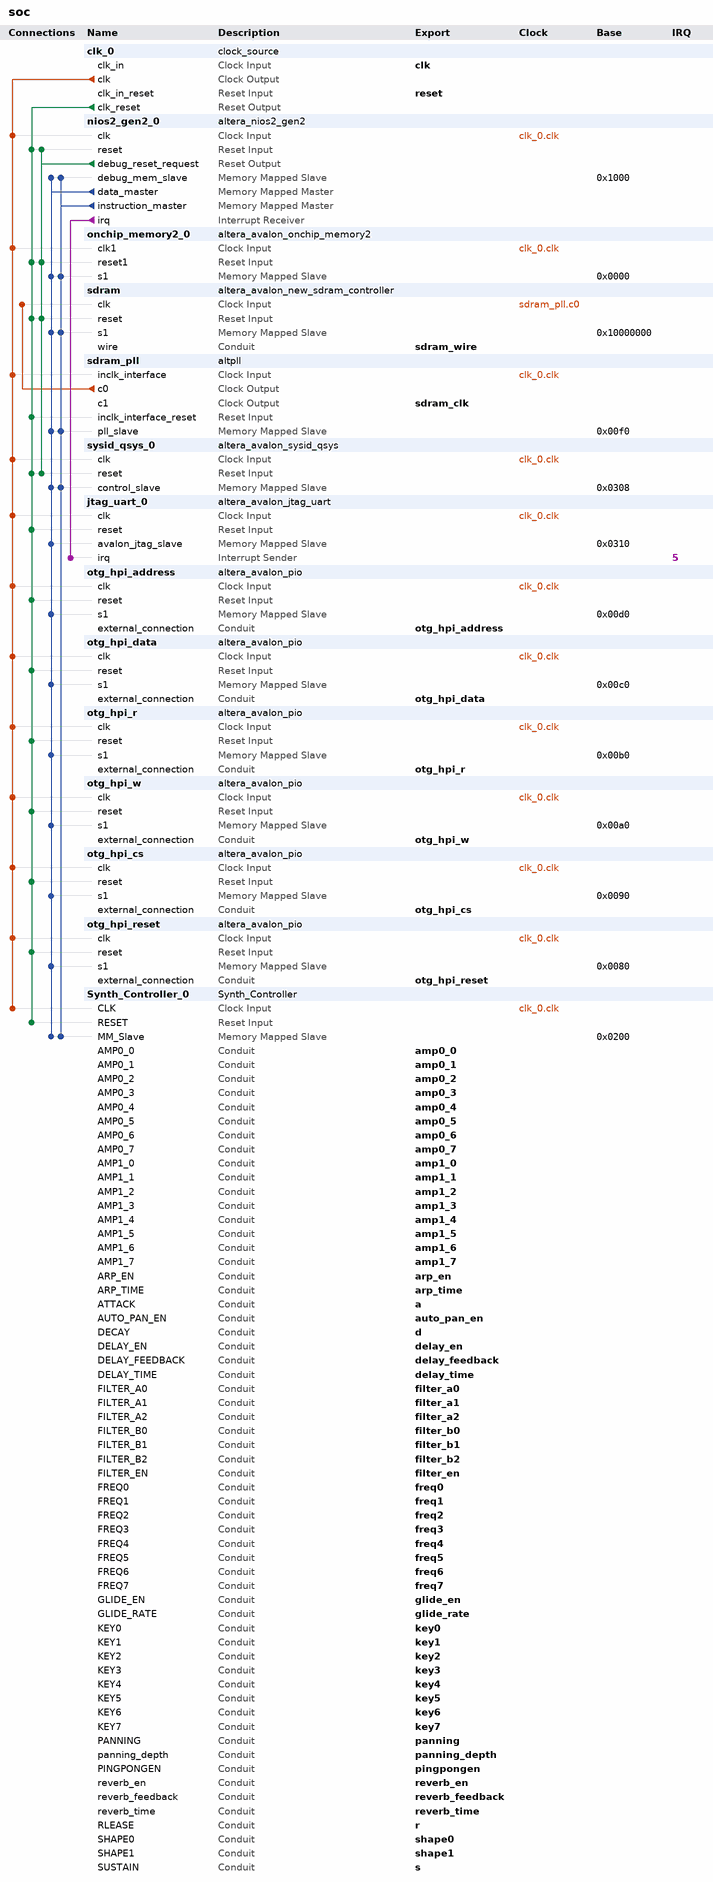
[diagram p0: system contents]
# Platform Designer (Qsys) system soc, Cyclone IV E EP4CE115F29C7
# Parameters at their usual value, and those the tool derives, are not listed.
package require -exact qsys 18.1
create_system soc
set_project_property DEVICE_FAMILY {Cyclone IV E}
set_project_property DEVICE EP4CE115F29C7

add_instance clk_0 clock_source 18.1
set_instance_parameter_value clk_0 clockFrequency 50000000

add_instance nios2_gen2_0 altera_nios2_gen2 18.1
set_instance_parameter_value nios2_gen2_0 dcache_size 2048
set_instance_parameter_value nios2_gen2_0 exceptionSlave sdram.s1
set_instance_parameter_value nios2_gen2_0 icache_size 4096
set_instance_parameter_value nios2_gen2_0 impl Tiny
set_instance_parameter_value nios2_gen2_0 resetSlave sdram.s1

add_instance onchip_memory2_0 altera_avalon_onchip_memory2 18.1
set_instance_parameter_value onchip_memory2_0 dataWidth 32
set_instance_parameter_value onchip_memory2_0 dualPort false
set_instance_parameter_value onchip_memory2_0 initMemContent true
set_instance_parameter_value onchip_memory2_0 initializationFileName onchip_mem.hex
set_instance_parameter_value onchip_memory2_0 memorySize 16

add_instance sdram altera_avalon_new_sdram_controller 18.1
set_instance_parameter_value sdram TAC 5.5
set_instance_parameter_value sdram TRCD 20.0
set_instance_parameter_value sdram TRP 20.0
set_instance_parameter_value sdram casLatency 3
set_instance_parameter_value sdram columnWidth 10
set_instance_parameter_value sdram dataWidth 32
set_instance_parameter_value sdram generateSimulationModel false
set_instance_parameter_value sdram model single_Micron_MT48LC4M32B2_7_chip
set_instance_parameter_value sdram numberOfBanks 4
set_instance_parameter_value sdram numberOfChipSelects 1
set_instance_parameter_value sdram powerUpDelay 200.0
set_instance_parameter_value sdram refreshPeriod 7.8125
set_instance_parameter_value sdram rowWidth 13

add_instance sdram_pll altpll 18.1
set_instance_parameter_value sdram_pll CLK0_DIVIDE_BY 1
set_instance_parameter_value sdram_pll CLK0_MULTIPLY_BY 1
set_instance_parameter_value sdram_pll CLK1_DIVIDE_BY 1
set_instance_parameter_value sdram_pll CLK1_DUTY_CYCLE 50
set_instance_parameter_value sdram_pll CLK1_MULTIPLY_BY 1
set_instance_parameter_value sdram_pll CLK1_PHASE_SHIFT -3000
set_instance_parameter_value sdram_pll INCLK0_INPUT_FREQUENCY 20000
set_instance_parameter_value sdram_pll PORT_ARESET PORT_UNUSED
set_instance_parameter_value sdram_pll PORT_LOCKED PORT_UNUSED
set_instance_parameter_value sdram_pll PORT_clk1 PORT_USED
set_instance_parameter_value sdram_pll PORT_clk2 PORT_UNUSED
set_instance_parameter_value sdram_pll PORT_clk3 PORT_UNUSED

add_instance sysid_qsys_0 altera_avalon_sysid_qsys 18.1
set_instance_parameter_value sysid_qsys_0 id 0

add_instance jtag_uart_0 altera_avalon_jtag_uart 18.1
set_instance_parameter_value jtag_uart_0 simInteractiveOptions NO_INTERACTIVE_WINDOWS

add_instance otg_hpi_address altera_avalon_pio 18.1
set_instance_parameter_value otg_hpi_address direction Output
set_instance_parameter_value otg_hpi_address width 2

add_instance otg_hpi_data altera_avalon_pio 18.1
set_instance_parameter_value otg_hpi_data direction InOut
set_instance_parameter_value otg_hpi_data width 16

add_instance otg_hpi_r altera_avalon_pio 18.1
set_instance_parameter_value otg_hpi_r direction Output
set_instance_parameter_value otg_hpi_r width 1

add_instance otg_hpi_w altera_avalon_pio 18.1
set_instance_parameter_value otg_hpi_w direction Output
set_instance_parameter_value otg_hpi_w width 1

add_instance otg_hpi_cs altera_avalon_pio 18.1
set_instance_parameter_value otg_hpi_cs direction Output
set_instance_parameter_value otg_hpi_cs width 1

add_instance otg_hpi_reset altera_avalon_pio 18.1
set_instance_parameter_value otg_hpi_reset direction Output
set_instance_parameter_value otg_hpi_reset width 1

add_instance Synth_Controller_0 Synth_Controller 1.0

# connections
add_connection clk_0.clk jtag_uart_0.clk clock
add_connection clk_0.clk nios2_gen2_0.clk clock
add_connection clk_0.clk onchip_memory2_0.clk1 clock
add_connection clk_0.clk otg_hpi_address.clk clock
add_connection clk_0.clk otg_hpi_cs.clk clock
add_connection clk_0.clk otg_hpi_data.clk clock
add_connection clk_0.clk otg_hpi_r.clk clock
add_connection clk_0.clk otg_hpi_reset.clk clock
add_connection clk_0.clk otg_hpi_w.clk clock
add_connection clk_0.clk sdram_pll.inclk_interface clock
add_connection clk_0.clk Synth_Controller_0.CLK clock
add_connection clk_0.clk sysid_qsys_0.clk clock
add_connection sdram_pll.c0 sdram.clk clock
add_connection clk_0.clk_reset jtag_uart_0.reset reset
add_connection clk_0.clk_reset nios2_gen2_0.reset reset
add_connection clk_0.clk_reset onchip_memory2_0.reset1 reset
add_connection clk_0.clk_reset otg_hpi_address.reset reset
add_connection clk_0.clk_reset otg_hpi_cs.reset reset
add_connection clk_0.clk_reset otg_hpi_data.reset reset
add_connection clk_0.clk_reset otg_hpi_r.reset reset
add_connection clk_0.clk_reset otg_hpi_reset.reset reset
add_connection clk_0.clk_reset otg_hpi_w.reset reset
add_connection clk_0.clk_reset sdram.reset reset
add_connection clk_0.clk_reset sdram_pll.inclk_interface_reset reset
add_connection clk_0.clk_reset Synth_Controller_0.RESET reset
add_connection clk_0.clk_reset sysid_qsys_0.reset reset
add_connection nios2_gen2_0.debug_reset_request nios2_gen2_0.reset reset
add_connection nios2_gen2_0.debug_reset_request onchip_memory2_0.reset1 reset
add_connection nios2_gen2_0.debug_reset_request sdram.reset reset
add_connection nios2_gen2_0.debug_reset_request sysid_qsys_0.reset reset
add_connection nios2_gen2_0.data_master jtag_uart_0.avalon_jtag_slave avalon
set_connection_parameter_value nios2_gen2_0.data_master/jtag_uart_0.avalon_jtag_slave baseAddress 0x0310
add_connection nios2_gen2_0.data_master nios2_gen2_0.debug_mem_slave avalon
set_connection_parameter_value nios2_gen2_0.data_master/nios2_gen2_0.debug_mem_slave baseAddress 0x1000
add_connection nios2_gen2_0.data_master onchip_memory2_0.s1 avalon
set_connection_parameter_value nios2_gen2_0.data_master/onchip_memory2_0.s1 baseAddress 0x0000
add_connection nios2_gen2_0.data_master otg_hpi_address.s1 avalon
set_connection_parameter_value nios2_gen2_0.data_master/otg_hpi_address.s1 baseAddress 0x00d0
add_connection nios2_gen2_0.data_master otg_hpi_cs.s1 avalon
set_connection_parameter_value nios2_gen2_0.data_master/otg_hpi_cs.s1 baseAddress 0x0090
add_connection nios2_gen2_0.data_master otg_hpi_data.s1 avalon
set_connection_parameter_value nios2_gen2_0.data_master/otg_hpi_data.s1 baseAddress 0x00c0
add_connection nios2_gen2_0.data_master otg_hpi_r.s1 avalon
set_connection_parameter_value nios2_gen2_0.data_master/otg_hpi_r.s1 baseAddress 0x00b0
add_connection nios2_gen2_0.data_master otg_hpi_reset.s1 avalon
set_connection_parameter_value nios2_gen2_0.data_master/otg_hpi_reset.s1 baseAddress 0x0080
add_connection nios2_gen2_0.data_master otg_hpi_w.s1 avalon
set_connection_parameter_value nios2_gen2_0.data_master/otg_hpi_w.s1 baseAddress 0x00a0
add_connection nios2_gen2_0.data_master sdram.s1 avalon
set_connection_parameter_value nios2_gen2_0.data_master/sdram.s1 baseAddress 0x10000000
add_connection nios2_gen2_0.data_master sdram_pll.pll_slave avalon
set_connection_parameter_value nios2_gen2_0.data_master/sdram_pll.pll_slave baseAddress 0x00f0
add_connection nios2_gen2_0.data_master Synth_Controller_0.MM_Slave avalon
set_connection_parameter_value nios2_gen2_0.data_master/Synth_Controller_0.MM_Slave baseAddress 0x0200
add_connection nios2_gen2_0.data_master sysid_qsys_0.control_slave avalon
set_connection_parameter_value nios2_gen2_0.data_master/sysid_qsys_0.control_slave baseAddress 0x0308
add_connection nios2_gen2_0.instruction_master nios2_gen2_0.debug_mem_slave avalon
set_connection_parameter_value nios2_gen2_0.instruction_master/nios2_gen2_0.debug_mem_slave baseAddress 0x1000
add_connection nios2_gen2_0.instruction_master onchip_memory2_0.s1 avalon
set_connection_parameter_value nios2_gen2_0.instruction_master/onchip_memory2_0.s1 baseAddress 0x0000
add_connection nios2_gen2_0.instruction_master sdram.s1 avalon
set_connection_parameter_value nios2_gen2_0.instruction_master/sdram.s1 baseAddress 0x10000000
add_connection nios2_gen2_0.instruction_master sdram_pll.pll_slave avalon
set_connection_parameter_value nios2_gen2_0.instruction_master/sdram_pll.pll_slave baseAddress 0x00f0
add_connection nios2_gen2_0.instruction_master Synth_Controller_0.MM_Slave avalon
set_connection_parameter_value nios2_gen2_0.instruction_master/Synth_Controller_0.MM_Slave baseAddress 0x0200
add_connection nios2_gen2_0.instruction_master sysid_qsys_0.control_slave avalon
set_connection_parameter_value nios2_gen2_0.instruction_master/sysid_qsys_0.control_slave baseAddress 0x0308
add_connection nios2_gen2_0.irq jtag_uart_0.irq interrupt
set_connection_parameter_value nios2_gen2_0.irq/jtag_uart_0.irq irqNumber 5

# exported interfaces
add_interface a conduit end
set_interface_property a EXPORT_OF Synth_Controller_0.ATTACK
add_interface amp0_0 conduit end
set_interface_property amp0_0 EXPORT_OF Synth_Controller_0.AMP0_0
add_interface amp0_1 conduit end
set_interface_property amp0_1 EXPORT_OF Synth_Controller_0.AMP0_1
add_interface amp0_2 conduit end
set_interface_property amp0_2 EXPORT_OF Synth_Controller_0.AMP0_2
add_interface amp0_3 conduit end
set_interface_property amp0_3 EXPORT_OF Synth_Controller_0.AMP0_3
add_interface amp0_4 conduit end
set_interface_property amp0_4 EXPORT_OF Synth_Controller_0.AMP0_4
add_interface amp0_5 conduit end
set_interface_property amp0_5 EXPORT_OF Synth_Controller_0.AMP0_5
add_interface amp0_6 conduit end
set_interface_property amp0_6 EXPORT_OF Synth_Controller_0.AMP0_6
add_interface amp0_7 conduit end
set_interface_property amp0_7 EXPORT_OF Synth_Controller_0.AMP0_7
add_interface amp1_0 conduit end
set_interface_property amp1_0 EXPORT_OF Synth_Controller_0.AMP1_0
add_interface amp1_1 conduit end
set_interface_property amp1_1 EXPORT_OF Synth_Controller_0.AMP1_1
add_interface amp1_2 conduit end
set_interface_property amp1_2 EXPORT_OF Synth_Controller_0.AMP1_2
add_interface amp1_3 conduit end
set_interface_property amp1_3 EXPORT_OF Synth_Controller_0.AMP1_3
add_interface amp1_4 conduit end
set_interface_property amp1_4 EXPORT_OF Synth_Controller_0.AMP1_4
add_interface amp1_5 conduit end
set_interface_property amp1_5 EXPORT_OF Synth_Controller_0.AMP1_5
add_interface amp1_6 conduit end
set_interface_property amp1_6 EXPORT_OF Synth_Controller_0.AMP1_6
add_interface amp1_7 conduit end
set_interface_property amp1_7 EXPORT_OF Synth_Controller_0.AMP1_7
add_interface arp_en conduit end
set_interface_property arp_en EXPORT_OF Synth_Controller_0.ARP_EN
add_interface arp_time conduit end
set_interface_property arp_time EXPORT_OF Synth_Controller_0.ARP_TIME
add_interface auto_pan_en conduit end
set_interface_property auto_pan_en EXPORT_OF Synth_Controller_0.AUTO_PAN_EN
add_interface clk clock sink
set_interface_property clk EXPORT_OF clk_0.clk_in
add_interface d conduit end
set_interface_property d EXPORT_OF Synth_Controller_0.DECAY
add_interface delay_en conduit end
set_interface_property delay_en EXPORT_OF Synth_Controller_0.DELAY_EN
add_interface delay_feedback conduit end
set_interface_property delay_feedback EXPORT_OF Synth_Controller_0.DELAY_FEEDBACK
add_interface delay_time conduit end
set_interface_property delay_time EXPORT_OF Synth_Controller_0.DELAY_TIME
add_interface filter_a0 conduit end
set_interface_property filter_a0 EXPORT_OF Synth_Controller_0.FILTER_A0
add_interface filter_a1 conduit end
set_interface_property filter_a1 EXPORT_OF Synth_Controller_0.FILTER_A1
add_interface filter_a2 conduit end
set_interface_property filter_a2 EXPORT_OF Synth_Controller_0.FILTER_A2
add_interface filter_b0 conduit end
set_interface_property filter_b0 EXPORT_OF Synth_Controller_0.FILTER_B0
add_interface filter_b1 conduit end
set_interface_property filter_b1 EXPORT_OF Synth_Controller_0.FILTER_B1
add_interface filter_b2 conduit end
set_interface_property filter_b2 EXPORT_OF Synth_Controller_0.FILTER_B2
add_interface filter_en conduit end
set_interface_property filter_en EXPORT_OF Synth_Controller_0.FILTER_EN
add_interface freq0 conduit end
set_interface_property freq0 EXPORT_OF Synth_Controller_0.FREQ0
add_interface freq1 conduit end
set_interface_property freq1 EXPORT_OF Synth_Controller_0.FREQ1
add_interface freq2 conduit end
set_interface_property freq2 EXPORT_OF Synth_Controller_0.FREQ2
add_interface freq3 conduit end
set_interface_property freq3 EXPORT_OF Synth_Controller_0.FREQ3
add_interface freq4 conduit end
set_interface_property freq4 EXPORT_OF Synth_Controller_0.FREQ4
add_interface freq5 conduit end
set_interface_property freq5 EXPORT_OF Synth_Controller_0.FREQ5
add_interface freq6 conduit end
set_interface_property freq6 EXPORT_OF Synth_Controller_0.FREQ6
add_interface freq7 conduit end
set_interface_property freq7 EXPORT_OF Synth_Controller_0.FREQ7
add_interface glide_en conduit end
set_interface_property glide_en EXPORT_OF Synth_Controller_0.GLIDE_EN
add_interface glide_rate conduit end
set_interface_property glide_rate EXPORT_OF Synth_Controller_0.GLIDE_RATE
add_interface key0 conduit end
set_interface_property key0 EXPORT_OF Synth_Controller_0.KEY0
add_interface key1 conduit end
set_interface_property key1 EXPORT_OF Synth_Controller_0.KEY1
add_interface key2 conduit end
set_interface_property key2 EXPORT_OF Synth_Controller_0.KEY2
add_interface key3 conduit end
set_interface_property key3 EXPORT_OF Synth_Controller_0.KEY3
add_interface key4 conduit end
set_interface_property key4 EXPORT_OF Synth_Controller_0.KEY4
add_interface key5 conduit end
set_interface_property key5 EXPORT_OF Synth_Controller_0.KEY5
add_interface key6 conduit end
set_interface_property key6 EXPORT_OF Synth_Controller_0.KEY6
add_interface key7 conduit end
set_interface_property key7 EXPORT_OF Synth_Controller_0.KEY7
add_interface otg_hpi_address conduit end
set_interface_property otg_hpi_address EXPORT_OF otg_hpi_address.external_connection
add_interface otg_hpi_cs conduit end
set_interface_property otg_hpi_cs EXPORT_OF otg_hpi_cs.external_connection
add_interface otg_hpi_data conduit end
set_interface_property otg_hpi_data EXPORT_OF otg_hpi_data.external_connection
add_interface otg_hpi_r conduit end
set_interface_property otg_hpi_r EXPORT_OF otg_hpi_r.external_connection
add_interface otg_hpi_reset conduit end
set_interface_property otg_hpi_reset EXPORT_OF otg_hpi_reset.external_connection
add_interface otg_hpi_w conduit end
set_interface_property otg_hpi_w EXPORT_OF otg_hpi_w.external_connection
add_interface panning conduit end
set_interface_property panning EXPORT_OF Synth_Controller_0.PANNING
add_interface panning_depth conduit end
set_interface_property panning_depth EXPORT_OF Synth_Controller_0.panning_depth
add_interface pingpongen conduit end
set_interface_property pingpongen EXPORT_OF Synth_Controller_0.PINGPONGEN
add_interface r conduit end
set_interface_property r EXPORT_OF Synth_Controller_0.RLEASE
add_interface reset reset sink
set_interface_property reset EXPORT_OF clk_0.clk_in_reset
add_interface reverb_en conduit end
set_interface_property reverb_en EXPORT_OF Synth_Controller_0.reverb_en
add_interface reverb_feedback conduit end
set_interface_property reverb_feedback EXPORT_OF Synth_Controller_0.reverb_feedback
add_interface reverb_time conduit end
set_interface_property reverb_time EXPORT_OF Synth_Controller_0.reverb_time
add_interface s conduit end
set_interface_property s EXPORT_OF Synth_Controller_0.SUSTAIN
add_interface sdram_clk clock source
set_interface_property sdram_clk EXPORT_OF sdram_pll.c1
add_interface sdram_wire conduit end
set_interface_property sdram_wire EXPORT_OF sdram.wire
add_interface shape0 conduit end
set_interface_property shape0 EXPORT_OF Synth_Controller_0.SHAPE0
add_interface shape1 conduit end
set_interface_property shape1 EXPORT_OF Synth_Controller_0.SHAPE1

set_interconnect_requirement {$system} qsys_mm.clockCrossingAdapter HANDSHAKE
set_interconnect_requirement {$system} qsys_mm.enableEccProtection FALSE
set_interconnect_requirement {$system} qsys_mm.insertDefaultSlave FALSE
set_interconnect_requirement {$system} qsys_mm.maxAdditionalLatency 1

save_system soc.qsys
